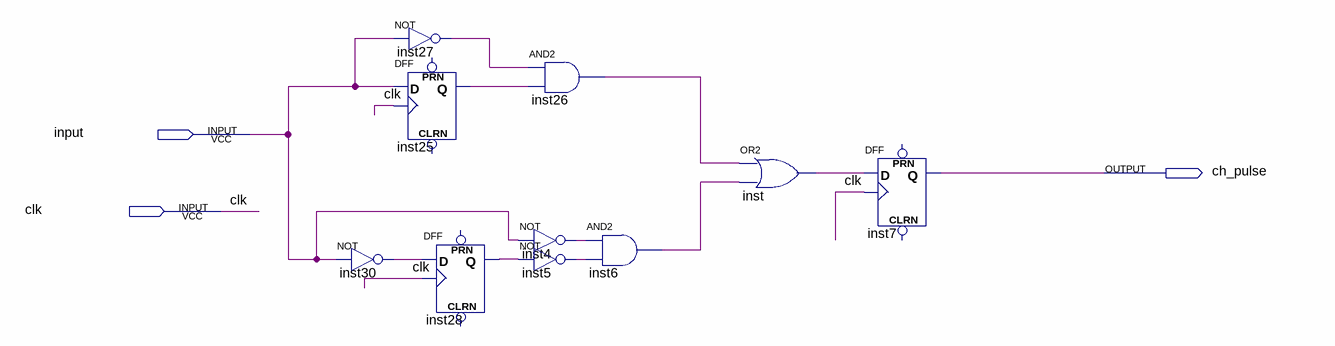
[diagram p0: schematic sheet]
// Quartus schematic Change_detector.bdf as structural Verilog: 10 symbols, 3 pins
module Change_detector (
  input  \input ,
  input  clk,
  output ch_pulse
);

  wire inst4_out, inst5_out, inst6_out, inst25_q, inst26_out, inst27_out, inst28_q, inst30_out, inst_out;

  not inst30 (inst30_out, \input );
  not inst27 (inst27_out, \input );
  DFF inst25 (.CLK(clk), .D(\input ), .Q(inst25_q));  // open: CLRN, PRN
  DFF inst28 (.CLK(clk), .D(inst30_out), .Q(inst28_q));  // open: CLRN, PRN
  and inst26 (inst26_out, inst27_out, inst25_q);
  not inst4 (inst4_out, \input );
  not inst5 (inst5_out, inst28_q);
  and inst6 (inst6_out, inst4_out, inst5_out);
  or inst (inst_out, inst26_out, inst6_out);
  DFF inst7 (.CLK(clk), .D(inst_out), .Q(ch_pulse));  // open: CLRN, PRN
endmodule
